# Altium schematic sheet Sheet2.SCHDOC
size 420 x 297 mm; SheetNumber: 1; SheetTotal: 1; DocumentName: Sheet1.SCHDOC
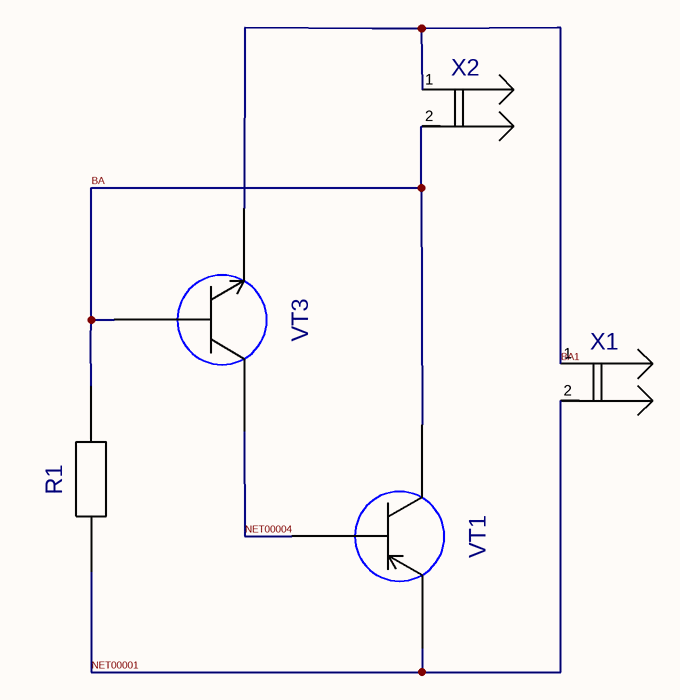
[diagram p0: Sheet2.SCHDOC]

## Parts
R1  MURATA MF12  [RES400]  (value not drawn)
VT1  КТ361  [КТ315]  (value not drawn)
VT3  КТ815  [КТ815]  (value not drawn)
X1  2XR  [2XR]  (value not drawn)
X2  2XR  [2XR]  (value not drawn)

## Nets
BA: R1.2(A2) VT1.2(A2) VT3.1(A1) X2.2(I/O2)
BA1: VT3.3(A3) X1.1(I/O1) X2.1(I/O1)
NET00001: R1.1(A1) VT1.3(A3) X1.2(I/O2)
NET00004: VT1.1(A1) VT3.2(A2)

## Library data of the parts
X1 X2 = 2XR: Value: *